# EAGLE design motor_driver (EAGLE 9.5.1)
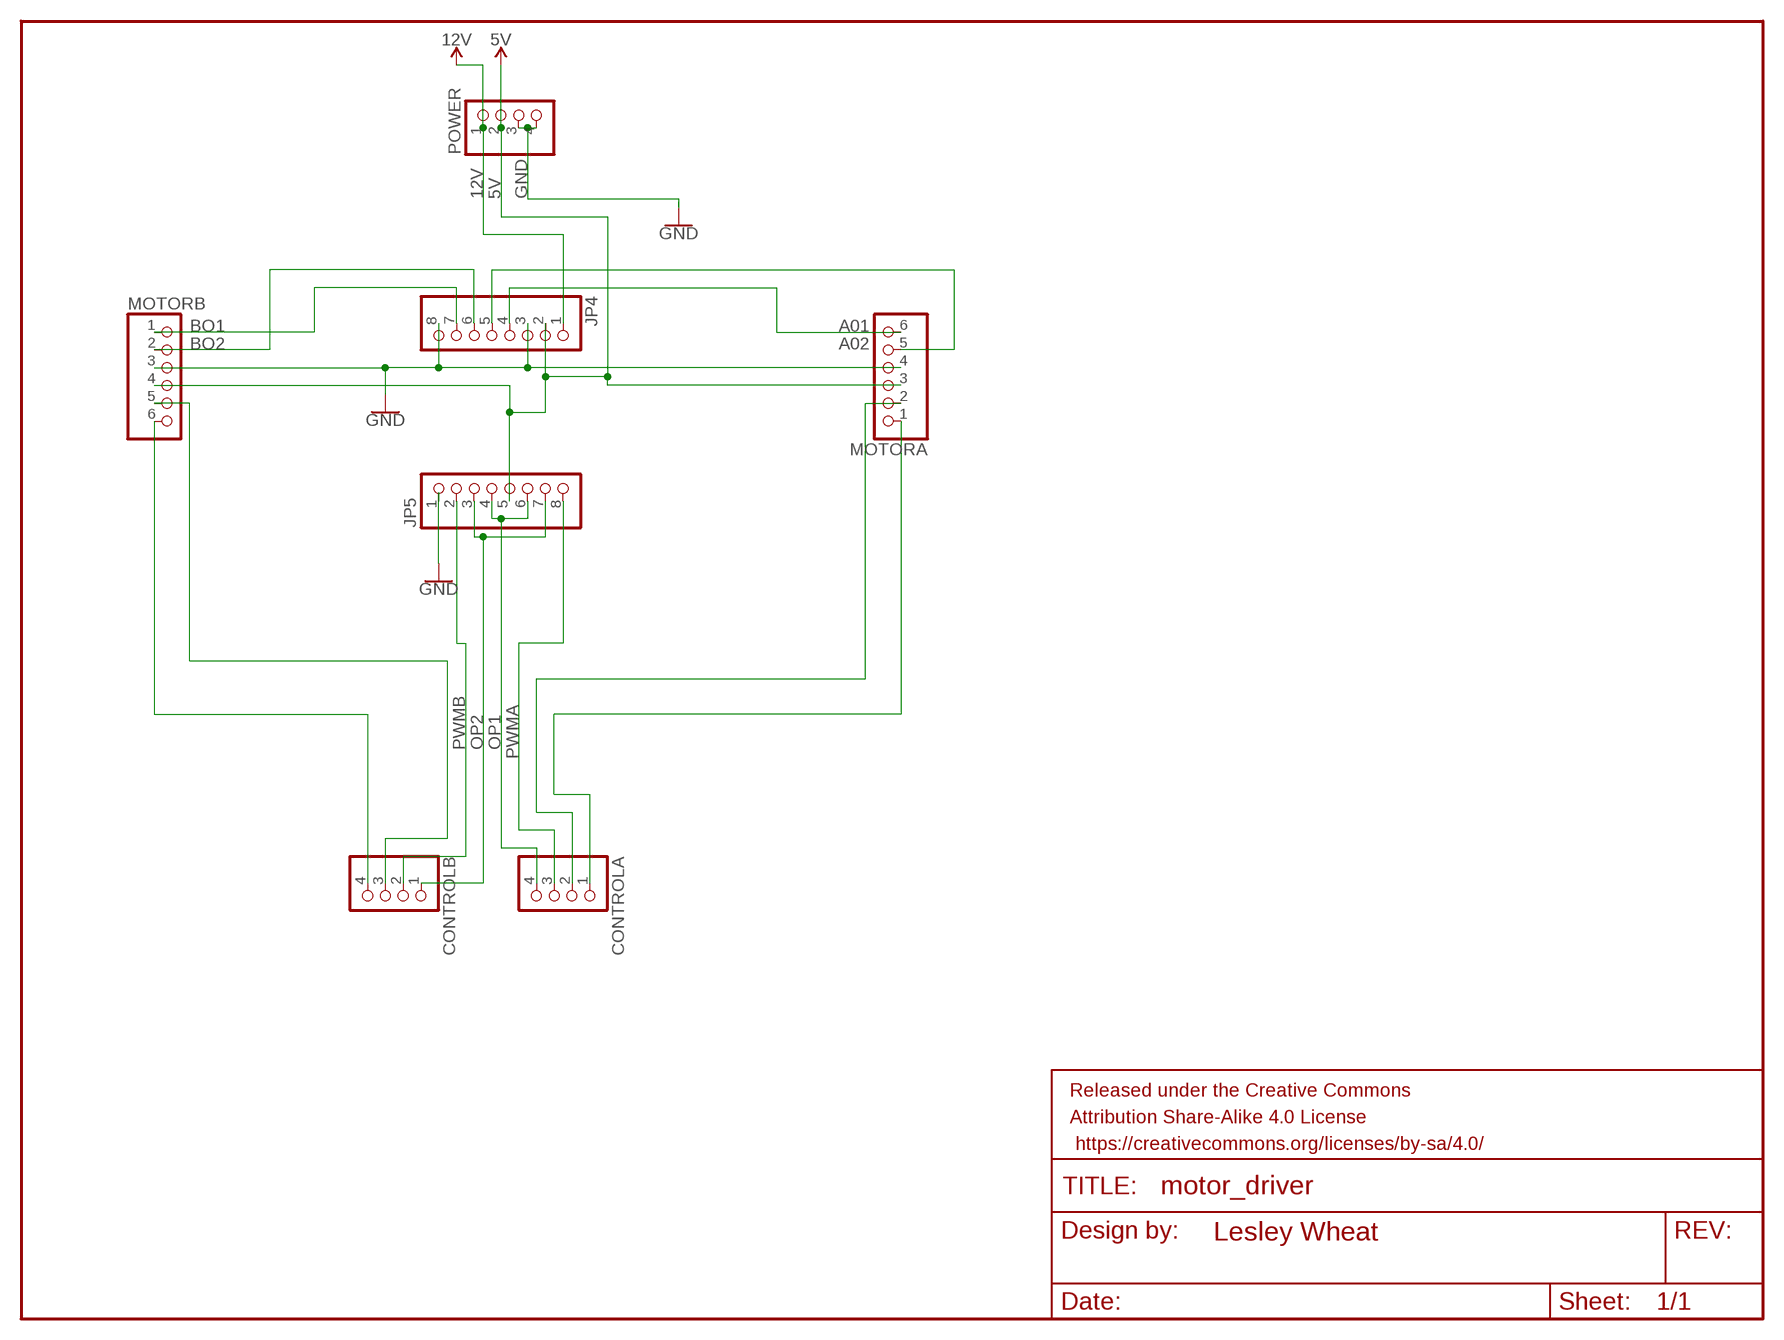
[diagram p0: schematic, sheet 1]

## Parts
CONTROLA  PINHD-1X4  [1X04]
CONTROLB  PINHD-1X4  [1X04]
FRAME2  FRAME-LETTERNO_PACKAGE  [DUMMY]
JP4  PINHD-1X8  [1X08]
JP5  PINHD-1X8  [1X08]
MOTORA  PINHD-1X6  [1X06]
MOTORB  PINHD-1X6  [1X06]
POWER  PINHD-1X4  [1X04]

## Nets
5V: JP4.2 JP5.5 MOTORA.3 MOTORB.4 POWER.2
12V: JP4.1 POWER.1
A01: JP4.4 MOTORA.6
A02: JP4.5 MOTORA.5
BO1: JP4.7 MOTORB.1
BO2: JP4.6 MOTORB.2
GND: JP4.3 JP4.8 JP5.1 MOTORA.4 MOTORB.3 POWER.3 POWER.4
N$7: CONTROLB.4 MOTORB.6
N$8: CONTROLA.1 MOTORA.1
N$11: CONTROLB.3 MOTORB.5
N$12: CONTROLA.2 MOTORA.2
OP1: CONTROLA.4 JP5.4 JP5.6
OP2: CONTROLB.1 JP5.3 JP5.7
PWMA: CONTROLA.3 JP5.8
PWMB: CONTROLB.2 JP5.2

## Library data of the parts
CONTROLA CONTROLB POWER = pinhead:PINHD-1X4: PIN HEADER
FRAME2 = SparkFun-Aesthetics:FRAME-LETTER: Schematic Frame - Letter Standard 8.5x11 US Letter frame; DESIGNER: Lesley Wheat; VERSION: v01
JP4 JP5 = pinhead:PINHD-1X8: PIN HEADER
MOTORA MOTORB = pinhead:PINHD-1X6: PIN HEADER

## Board
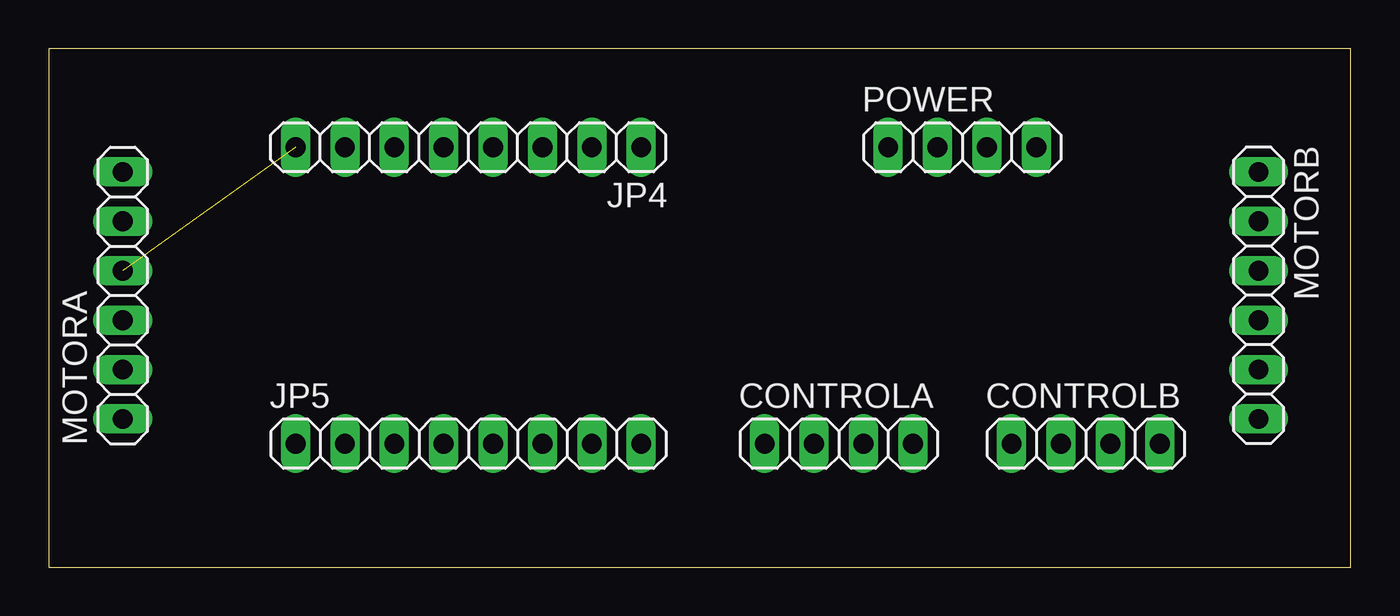
[diagram p1: board, top side]
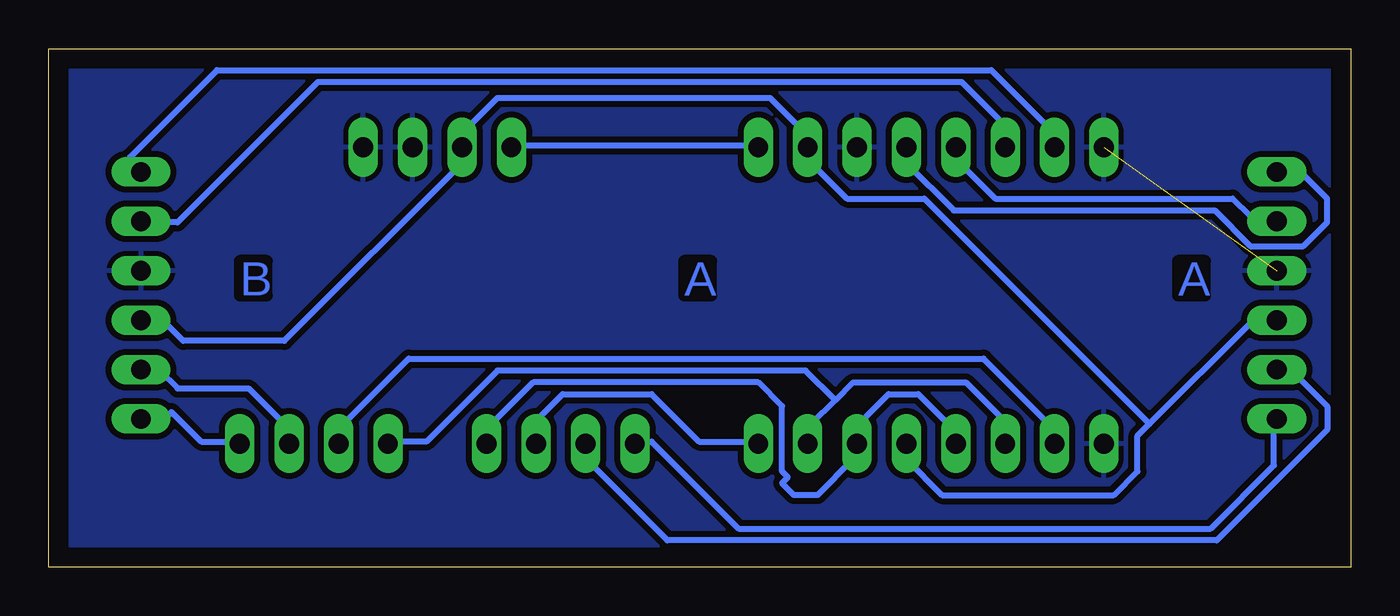
[diagram p2: board, bottom side, seen from below]

Size 66.98 x 26.66 mm. Coordinates in mm from the lower left corner, seen from the top.
Outline: 0,0 66.98,0 66.98,26.66 0,26.66 0,0
Copper layers (1*16): Top 0.035mm / dielectric 1.5mm / Bottom 0.035mm
Design rules "default *": minimum track width 12mil, minimum drill 20mil, track to track 12mil, track to pad 12mil, pad to pad 12mil, via to via 12mil, smd to smd 12mil, copper to edge 40mil, drill to drill 12mil, minimum pad ring 10mil, minimum via ring 8mil, stop-mask expansion 4mil, vias tented up to drill 0mil, thermal gap 10mil

### Footprints (pad centres in the part's own frame; a part is rotated, then mirrored left to right if it is on the bottom)
1X04 = drill 1.016 long: 1 -3.81,0; 2 -1.27,0; 3 1.27,0; 4 3.81,0
1X08 = drill 1.016 long: 1 -8.89,0; 2 -6.35,0; 3 -3.81,0; 4 -1.27,0; 5 1.27,0; 6 3.81,0; 7 6.35,0; 8 8.89,0
1X06 = drill 1.016 long: 1 -6.35,0; 2 -3.81,0; 3 -1.27,0; 4 1.27,0; 5 3.81,0; 6 6.35,0

### Placement (x,y rotation side)
CONTROLA  40.64,6.35 0 top
CONTROLB  53.34,6.35 0 top
FRAME2  -26.67,26.67 0 top  (outside the outline)
JP4  21.59,21.59 180 top
JP5  21.59,6.35 0 top
MOTORA  3.81,13.97 90 top
MOTORB  62.23,13.97 270 top
POWER  46.99,21.59 0 top

### Tracks (layer width: path | path; a pad name or v marks a point on that pad's centre or on a via)
5V
  Bottom 0.305: 10.36,7.37 10.97,6.76 10.97,4.93 12.19,3.71 21.03,3.71 22.86,5.54 JP5.5 | 10.36,7.37 5.18,12.55 3.96,12.55 MOTORA.3 | MOTORB.4 62.18,12.55 60.96,12.55 60.05,11.63 54.86,11.63 45.72,20.78 POWER.2 45.72,22.3 43.89,24.13 29.87,24.13 28.04,22.3 28.04,21.69 JP4.2 27.74,21.39 27.74,20.78 25.91,18.95 21.95,18.95 10.36,7.37
12V
  Bottom 0.305: JP4.1 30.48,21.69 42.98,21.69 POWER.1
A01
  Bottom 0.305: JP4.4 22.86,20.78 20.42,18.34 7.01,18.34 5.18,16.51 2.44,16.51 1.22,17.73 1.22,18.95 2.44,20.17 3.66,20.17 MOTORA.6
A02
  Bottom 0.305: MOTORA.5 3.96,18.03 5.18,18.03 6.1,18.95 18.29,18.95 20.12,20.78 20.12,21.39 JP4.5
BO1
  Bottom 0.305: JP4.7 15.24,22.3 18.49,25.55 58.32,25.55 62.79,21.08 62.79,20.78 62.48,20.47 MOTORB.1
BO2
  Bottom 0.305: MOTORB.2 62.18,17.73 60.35,17.73 53.14,24.94 20.02,24.94 17.98,22.91 17.98,21.69 JP4.6
GND  (1 unrouted)
  pour Bottom: 0,0 0,26.67 67.31,26.67 67.31,0
N$7
  Bottom 0.305: CONTROLB.4 57.3,6.45 59.13,6.45 60.66,7.98 60.96,7.67 62.18,7.67 MOTORB.6
N$8
  Bottom 0.305: MOTORA.1 3.96,7.37 3.96,5.23 7.21,1.98 31.5,1.98 35.97,6.45 36.58,6.45 CONTROLA.1
N$11
  Bottom 0.305: CONTROLB.3 54.86,6.45 54.86,7.37 56.69,9.2 60.35,9.2 61.27,10.11 62.18,10.11 MOTORB.5
N$12
  Bottom 0.305: CONTROLA.2 39.32,6.15 39.32,5.54 35.15,1.37 6.91,1.37 1.22,7.06 1.22,8.28 3.05,10.11 3.66,10.11 MOTORA.2
OP1
  Bottom 0.305: JP5.4 20.42,6.45 20.42,7.06 22.25,8.89 23.77,8.89 25.3,7.37 25.3,6.45 JP5.6 25.6,6.15 25.6,5.54 27.43,3.71 28.65,3.71 29.26,4.32 28.96,4.62 29.26,4.93 29.26,8.28 30.48,9.5 42.06,9.5 44.2,7.37 44.2,6.45 CONTROLA.4
OP2
  Bottom 0.305: 26.52,8.59 27.74,7.37 27.74,6.45 JP5.7 | 26.52,8.59 25.6,9.5 19.81,9.5 17.98,7.67 17.98,6.45 JP5.3 | 26.52,8.59 28.04,10.11 43.89,10.11 47.55,6.45 49.38,6.45 CONTROLB.1
PWMA
  Bottom 0.305: JP5.8 30.48,6.45 33.53,6.45 35.97,8.89 40.54,8.89 41.76,7.67 41.76,6.45 CONTROLA.3
PWMB
  Bottom 0.305: JP5.2 15.24,7.06 18.9,10.72 48.46,10.72 51.82,7.37 51.82,6.45 CONTROLB.2

### Text on the board
Bottom: A | A | B